# EAGLE schematic controls (EAGLE 6.3)
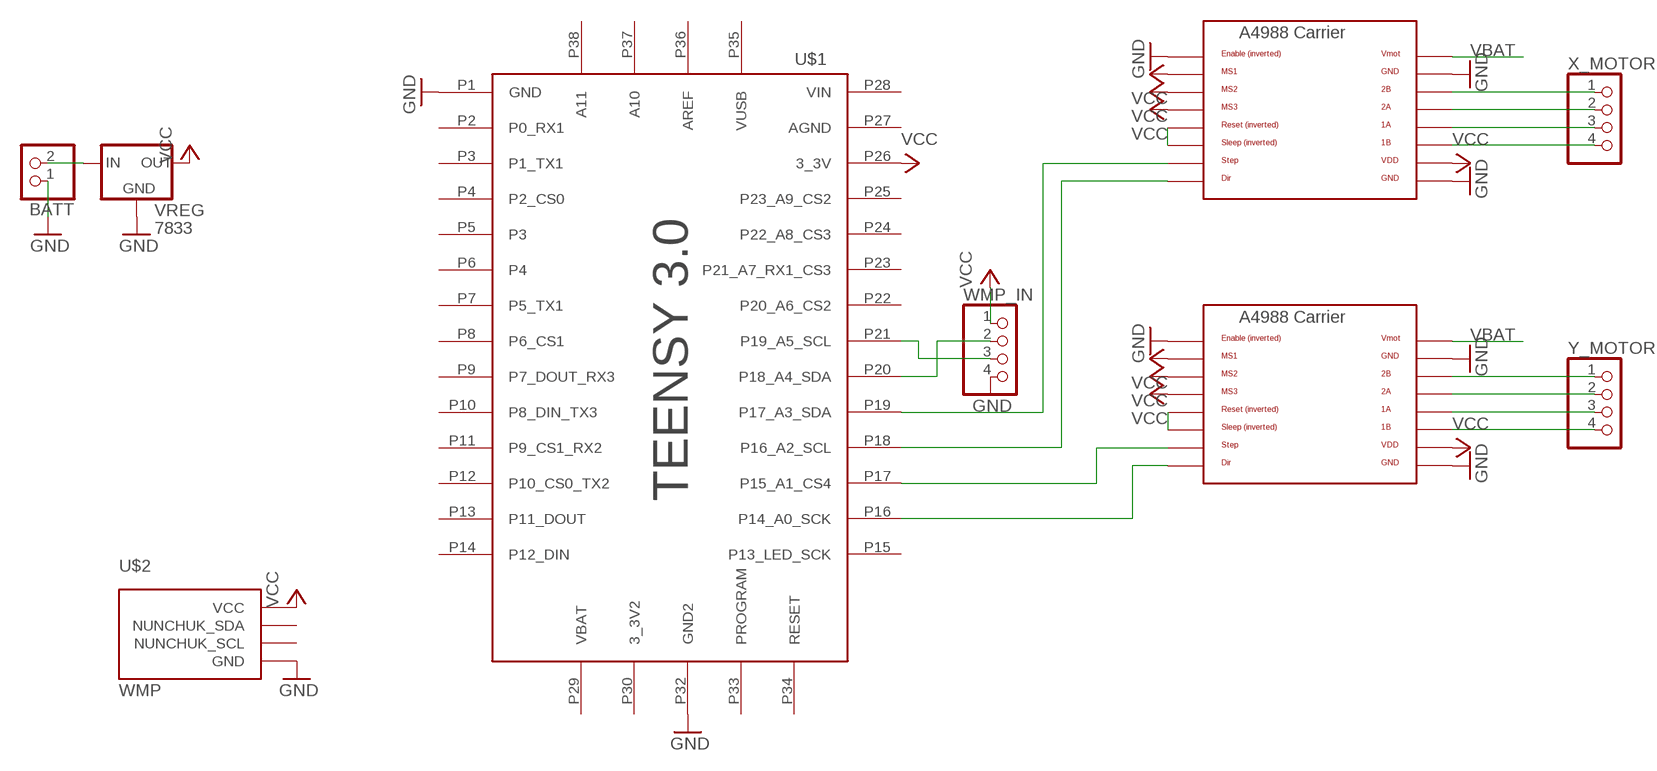
[diagram p0: schematic, sheet 1]

## Parts
BATT  PINHD-1X2  [1X02]
U$1  TEENSY3  [TEENSY3_BRD]
U$2  WMP  [WMP]
VREG  7833  78LXX  [78LXX]
WMP_IN  PINHD-1X4/90  [1X04/90]
X_DRIVE  POLOLU_A4983CARRIER  [A4988BREAKOUT]
X_MOTOR  PINHD-1X4/90  [1X04/90]
Y_DRIVE  POLOLU_A4983CARRIER  [A4988BREAKOUT]
Y_MOTOR  PINHD-1X4/90  [1X04/90]

## Nets
GND: BATT.1 U$1.P1(GND) U$1.P32(GND2) U$2.GND VREG.GND WMP_IN.4 X_DRIVE.EN X_DRIVE.GND X_DRIVE.GND@0(GND) Y_DRIVE.EN Y_DRIVE.GND Y_DRIVE.GND@0(GND)
N$1: X_DRIVE.2B X_MOTOR.1
N$2: X_DRIVE.2A X_MOTOR.2
N$3: X_DRIVE.1A X_MOTOR.3
N$4: X_DRIVE.1B X_MOTOR.4
N$5: Y_DRIVE.2B Y_MOTOR.1
N$6: Y_DRIVE.2A Y_MOTOR.2
N$7: Y_DRIVE.1A Y_MOTOR.3
N$8: Y_DRIVE.1B Y_MOTOR.4
N$9: Y_DRIVE.RST Y_DRIVE.SLP(SLEEP)
N$10: X_DRIVE.RST X_DRIVE.SLP(SLEEP)
N$11: U$1.P19(P17_A3_SDA) X_DRIVE.STEP
N$12: U$1.P18(P16_A2_SCL) X_DRIVE.DIR
N$13: U$1.P17(P15_A1_CS4) Y_DRIVE.STEP
N$14: U$1.P16(P14_A0_SCK) Y_DRIVE.DIR
N$15: U$1.P20(P18_A4_SDA) WMP_IN.2
N$16: U$1.P21(P19_A5_SCL) WMP_IN.3
VBAT: BATT.2 VREG.IN X_DRIVE.VMOT Y_DRIVE.VMOT
VCC: U$1.P26(3_3V) U$2.VCC VREG.OUT WMP_IN.1 X_DRIVE.MS1 X_DRIVE.MS2 X_DRIVE.MS3 X_DRIVE.VDD Y_DRIVE.MS1 Y_DRIVE.MS2 Y_DRIVE.MS3 Y_DRIVE.VDD
Unconnected: U$1.P2(P0_RX1) U$1.P3(P1_TX1) U$1.P4(P2_CS0) U$1.P5(P3) U$1.P6(P4) U$1.P7(P5_TX1) U$1.P8(P6_CS1) U$1.P9(P7_DOUT_RX3) U$1.P10(P8_DIN_TX3) U$1.P11(P9_CS1_RX2) U$1.P12(P10_CS0_TX2) U$1.P13(P11_DOUT) U$1.P14(P12_DIN) U$1.P15(P13_LED_SCK) U$1.P22(P20_A6_CS2) U$1.P23(P21_A7_RX1_CS3) U$1.P24(P22_A8_CS3) U$1.P25(P23_A9_CS2) U$1.P27(AGND) U$1.P28(VIN) U$1.P29(VBAT) U$1.P30(3_3V2) U$1.P33(PROGRAM) U$1.P34(RESET) U$1.P35(VUSB) U$1.P36(AREF) U$1.P37(A10) U$1.P38(A11) U$2.SCL(NUNCHUK_SCL) U$2.SDA(NUNCHUK_SDA)

## Library data of the parts
BATT = pinhead:PINHD-1X2: PIN HEADER
U$1 = Teensy:TEENSY3
U$2 = wmp:WMP: Wii Motion Plus board
VREG = RepRapjr:78LXX: VOLTAGE REGULATOR
WMP_IN X_MOTOR Y_MOTOR = pinhead:PINHD-1X4: PIN HEADER
X_DRIVE Y_DRIVE = RepRapjr:POLOLU_A4983CARRIER